# Altium schematic sheet DPPXHK_SENSOR.SCHDOC
size A4
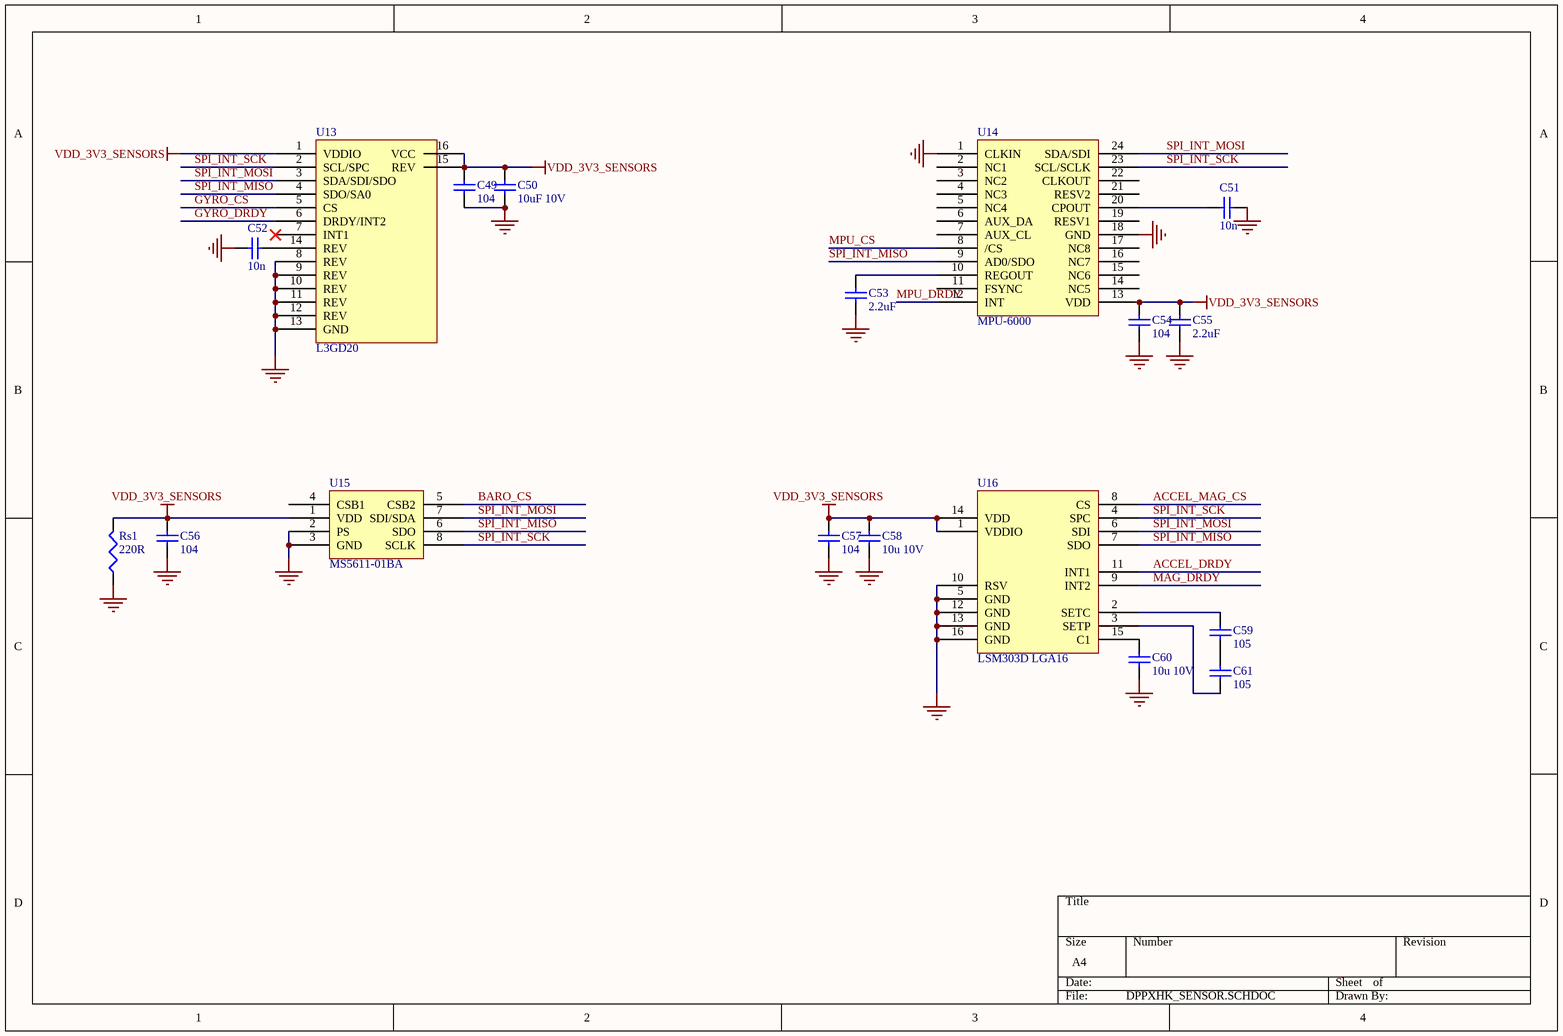
[diagram p0: DPPXHK_SENSOR.SCHDOC]

## Parts
C49  104  [LC0402]
C50  10uF 10V  [LC0402]
C51  10n  [LC0402]
C52  10n  [LC0402]
C53  2.2uF  [LC0402]
C54  104  [LC0402]
C55  2.2uF  [LC0402]
C56  104  [LC0402]
C57  104  [LC0402]
C58  10u 10V  [LC0402]
C59  105  [LC0402]
C60  10u 10V  [LC0402]
C61  105  [LC0402]
Rs1  220R  [0402R]
U13  L3GD20  [LGA_16]
U14  MPU-6000  [MPU_FP]
U15  MS5611-01BA  [MS5611-01]
U16  LSM303D LGA16  [LGA_3_3_16L]

## Nets
GND: C49.1 C50.1 C51.1 C52.1 C53.1 C54.1 C55.1 C56.1 C57.1 C58.1 C60.1 Rs1.1 U13.8(REV) U13.9(REV) U13.10(REV) U13.11(REV) U13.12(REV) U13.13(GND) U14.1(CLKIN) U14.18(GND) U15.2(PS) U15.3(GND) U16.5(GND) U16.10(RSV) U16.12(GND) U16.13(GND) U16.16(GND)
VDD_3V3_SENSORS: C49.2 C50.2 C54.2 C55.2 C56.2 C57.2 C58.2 Rs1.2 U13.1(VDDIO) U13.15(REV) U13.16(VCC) U14.13(VDD) U15.1(VDD) U16.1(VDDIO) U16.14(VDD)
ACCEL_DRDY: U16.11(INT1)
ACCEL_MAG_CS: U16.8(CS)
BARO_CS: U15.5(CSB2)
GYRO_CS: U13.5(CS)
GYRO_DRDY: U13.6(DRDY/INT2)
MAG_DRDY: U16.9(INT2)
MPU_CS: U14.8(/CS)
MPU_DRDY: U14.12(INT)
SPI_INT_MISO: U13.4(SDO/SA0) U14.9(AD0/SDO) U15.6(SDO) U16.7(SDO)
SPI_INT_MOSI: U13.3(SDA/SDI/SDO) U14.24(SDA/SDI) U15.7(SDI/SDA) U16.6(SDI)
SPI_INT_SCK: U13.2(SCL/SPC) U14.23(SCL/SCLK) U15.8(SCLK) U16.4(SPC)
NetC51_2: C51.2 U14.20(CPOUT)
NetC52_2: C52.2 U13.14(REV)
NetC53_2: C53.2 U14.10(REGOUT)
NetC59_1: C59.1 C61.2
NetC59_2: C59.2 U16.2(SETC)
NetC60_2: C60.2 U16.15(C1)
NetC61_1: C61.1 U16.3(SETP)

Not connected (* = marked no-connect by the designer): U13 7(INT1)*; U14 2(NC1) 3(NC2) 4(NC3) 5(NC4) 6(AUX_DA) 7(AUX_CL) 11(FSYNC) 14(NC5) 15(NC6) 16(NC7) 17(NC8) 19(RESV1) 21(RESV2) 22(CLKOUT); U15 4(CSB1)

## Library data of the parts
C49-C61 = Cap Semi: Capacitor (Semiconductor SIM Model); Published: 8-Jun-2000; LatestRevisionDate: 17-Jul-2002; LatestRevisionNote: Re-released for DXP Platform.; PackageReference: C1206; Publisher: Altium Limited
Rs1 = Res3: Resistor; Published: 8-Jun-2000; LatestRevisionDate: 4-Mar-2005; LatestRevisionNote: PCB Footprint replaced.; Publisher: Altium Limited